# EAGLE design IR4427 (EAGLE 6.6.0)
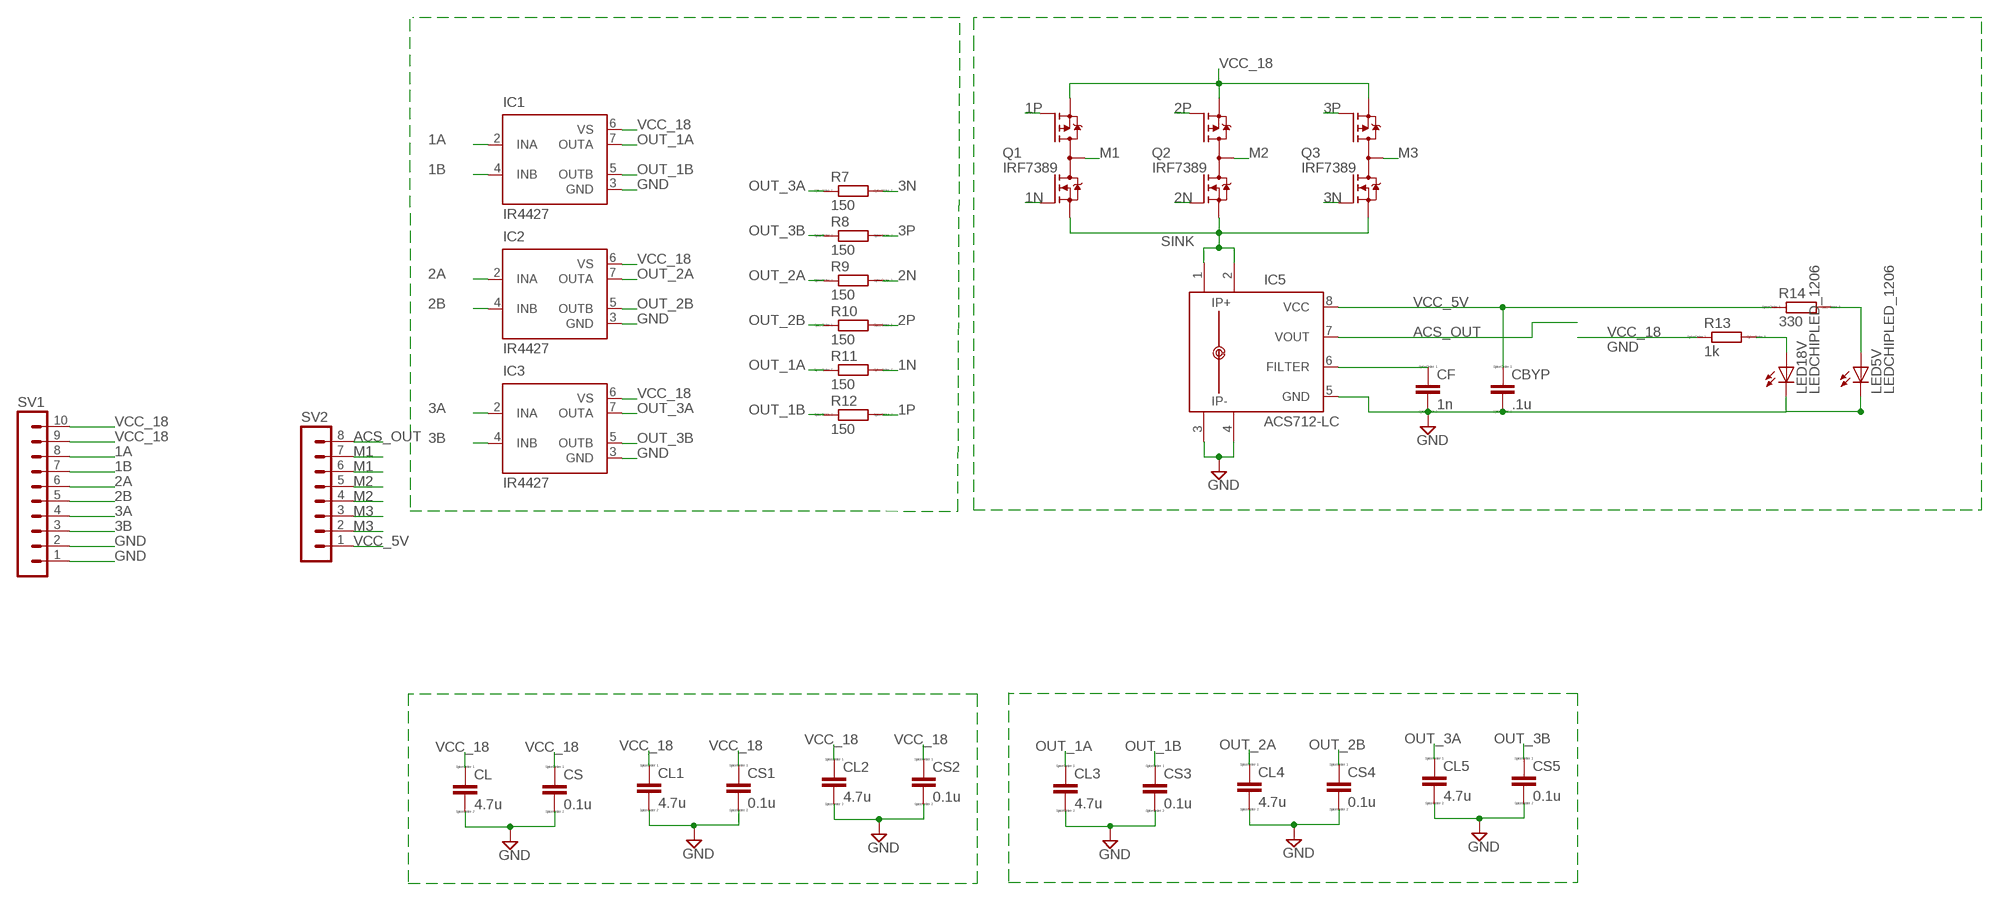
[diagram p0: schematic, sheet 1]

## Parts
CBYP  .1u  CC1206  [C1206]
CF  1n  CC1206  [C1206]
CL  4.7u  CC1206  [C1206]
CL1  4.7u  CC1206  [C1206]
CL2  4.7u  CC1206  [C1206]
CL3  4.7u  CC1206  [C1206]
CL4  4.7u  CC1206  [C1206]
CL5  4.7u  CC1206  [C1206]
CS  0.1u  CC1206  [C1206]
CS1  0.1u  CC1206  [C1206]
CS2  0.1u  CC1206  [C1206]
CS3  0.1u  CC1206  [C1206]
CS4  0.1u  CC1206  [C1206]
CS5  0.1u  CC1206  [C1206]
IC1  IR4427  [DIL08]
IC2  IR4427  [DIL08]
IC3  IR4427  [DIL08]
IC5  ACS712-LC  [SOIC8]
LED5V  LEDCHIPLED_1206  [CHIPLED_1206]
LED18V  LEDCHIPLED_1206  [CHIPLED_1206]
Q1  IRF7389  [SO08-IRF]
Q2  IRF7389  [SO08-IRF]
Q3  IRF7389  [SO08-IRF]
R7  150  RR1206  [R1206]
R8  150  RR1206  [R1206]
R9  150  RR1206  [R1206]
R10  150  RR1206  [R1206]
R11  150  RR1206  [R1206]
R12  150  RR1206  [R1206]
R13  1k  RR1206  [R1206]
R14  330  RR1206  [R1206]
SV1  MA10-1  [MA10-1]
SV2  MA08-1  [MA08-1]

## Nets
1A [signal]: IC1.2(INA) SV1.8
1B [signal]: IC1.4(INB) SV1.7
1N [signal]: Q1.2(N-G) R11.2
1P [signal]: Q1.4(P-G) R12.2
2A [signal]: IC2.2(INA) SV1.6
2B [signal]: IC2.4(INB) SV1.5
2N [signal]: Q2.2(N-G) R9.2
2P [signal]: Q2.4(P-G) R10.2
3A [signal]: IC3.2(INA) SV1.4
3B [signal]: IC3.4(INB) SV1.3
3N [signal]: Q3.2(N-G) R7.2
3P [signal]: Q3.4(P-G) R8.2
ACS_OUT [signal]: IC5.7(VOUT) SV2.8
GND [gnd]: CBYP.2 CF.2 CL1.2 CL2.2 CL3.2 CL4.2 CL5.2 CL.2 CS1.2 CS2.2 CS3.2 CS4.2 CS5.2 CS.2 IC1.3(GND) IC2.3(GND) IC3.3(GND) IC5.3(IP-) IC5.4(IP-1) IC5.5(GND) LED5V.C LED18V.C SV1.1 SV1.2
M1 [motor]: Q1.5(D) Q1.6(D) Q1.7(D) Q1.8(D) SV2.6 SV2.7
M2 [motor]: Q2.5(D) Q2.6(D) Q2.7(D) Q2.8(D) SV2.4 SV2.5
M3 [motor]: Q3.5(D) Q3.6(D) Q3.7(D) Q3.8(D) SV2.2 SV2.3
N$2 [5v]: LED18V.A R13.2
N$3 [5v]: CF.1 IC5.6(FILTER)
N$4 [signal]: LED5V.A R14.2
OUT_1A [signal]: CL3.1 IC1.7(OUTA) R11.1
OUT_1B [signal]: CS3.1 IC1.5(OUTB) R12.1
OUT_2A [signal]: CL4.1 IC2.7(OUTA) R9.1
OUT_2B [signal]: CS4.1 IC2.5(OUTB) R10.1
OUT_3A [signal]: CL5.1 IC3.7(OUTA) R7.1
OUT_3B [signal]: CS5.1 IC3.5(OUTB) R8.1
SINK [signal]: IC5.1(IP+) IC5.2(IP+1) Q1.1(N-S) Q2.1(N-S) Q3.1(N-S)
VCC_5V [5v]: CBYP.1 IC5.8(VCC) R14.1 SV2.1
VCC_18 [motor]: CL1.1 CL2.1 CL.1 CS1.1 CS2.1 CS.1 IC1.6(VS) IC2.6(VS) IC3.6(VS) Q1.3(P-S) Q2.3(P-S) Q3.3(P-S) R13.1 SV1.9 SV1.10

## Library data of the parts
CBYP CF CL CL1-CL5 CS CS1-CS5 = eagle-ltspice:C: CAPACITOR, European symbol; SPICEMODEL: NONE; SPICEPREFIX: C
IC1-IC3 = ir:IR4427: DUAL LOW SIDE DRIVER Source: ID4426.pdf; MF: INTERNATIONAL RECTIFIER(IR); MPN: IR4427; OC_FARNELL: 1023267; OC_NEWARK: 27C6914
IC5 = allegro-2:ACS712-LC
LED5V LED18V = audio amplifier example:LED
Q1-Q3 = transistor-fet:IRF7389: Complimentary Half Bridge HEXFET Power MOSFET Source: http://www.irf.com/product-info/datasheets/data/irf7389.pdf
R7-R14 = eagle-ltspice:R: RESISTOR, European symbol; SPICEMODEL: NONE; SPICEPREFIX: R
SV1 = con-lstb:MA10-1: PIN HEADER; OC_FARNELL: unknown; OC_NEWARK: unknown
SV2 = con-lstb:MA08-1: PIN HEADER; OC_FARNELL: unknown; OC_NEWARK: unknown

## Net classes
0 18v: width 1.4 mm, drill 0.4 mm, clearance 0.152 mm
1 5v: width 0.4 mm, drill 0.4 mm, clearance 0.152 mm
2 motor: width 1.4 mm, drill 0.4 mm, clearance 0.152 mm
3 signal: width 0.3 mm, drill 0.4 mm, clearance 0.152 mm
4 gnd: width 1.4 mm, drill 0.4 mm, clearance 0.152 mm

## Board
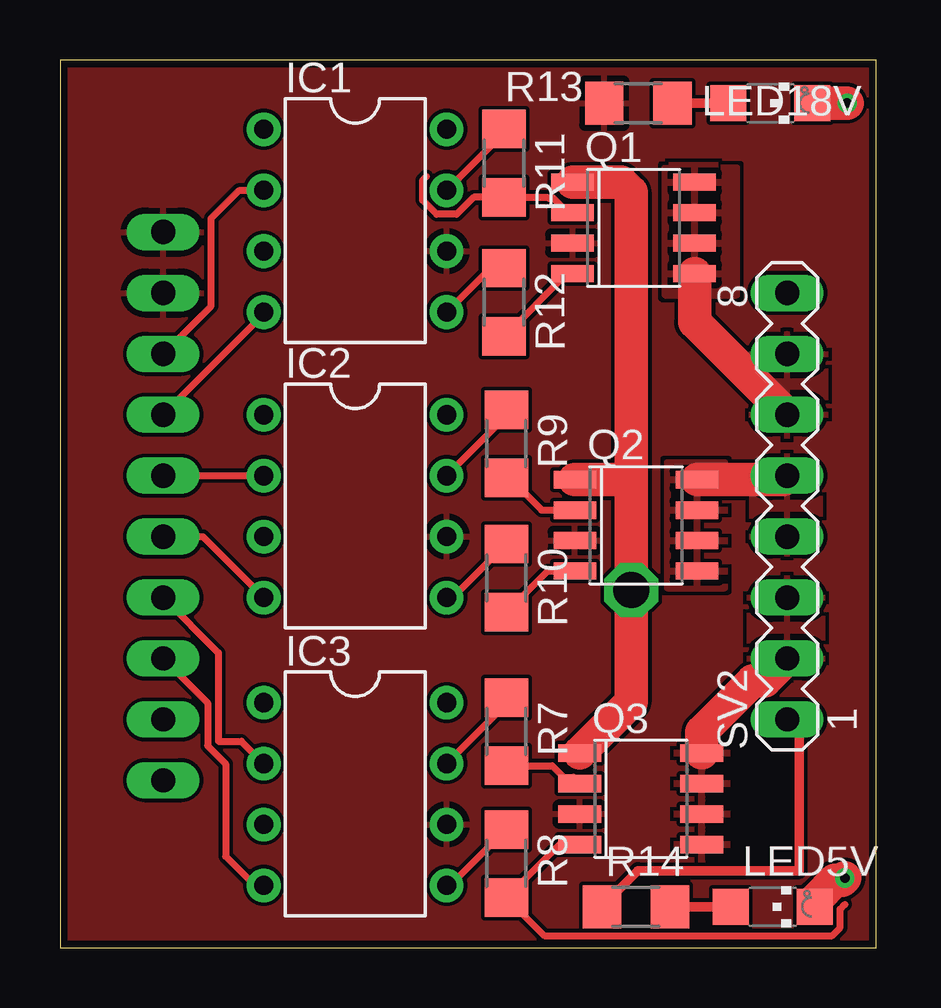
[diagram p1: board, top side]
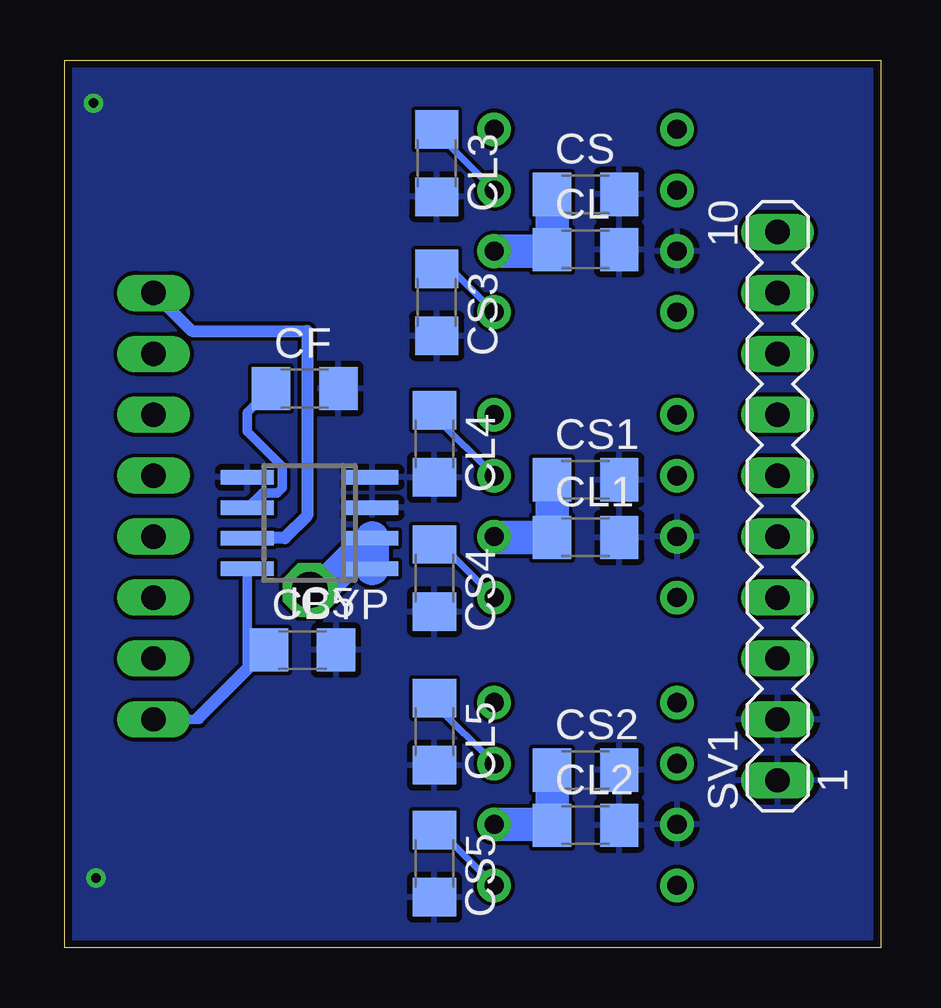
[diagram p2: board, bottom side, seen from below]

Size 34 x 37 mm. Coordinates in mm from the lower left corner, seen from the top.
Outline: 0,0 34,0 34,37 0,37 0,0
Copper layers (1*16): Top 0.035mm / dielectric 1.5mm / Bottom 0.035mm
Design rules "default *": minimum track width 6mil, minimum drill 0.35mm, track to track 6mil, track to pad 6mil, pad to pad 6mil, via to via 6mil, smd to smd 6mil, copper to edge 0.3mm, drill to drill 6mil, minimum pad ring 10mil, minimum via ring 8mil, stop-mask expansion 4mil, vias tented up to drill 0mil, thermal gap 10mil

### Footprints (pad centres in the part's own frame; a part is rotated, then mirrored left to right if it is on the bottom)
C1206 = smd 1.6 x 1.8: 1 -1.4,0; 2 1.4,0
DIL08 = drill 0.8 pad 1.4: 1 -3.81,-3.81; 2 -1.27,-3.81; 3 1.27,-3.81; 4 3.81,-3.81; 5 3.81,3.81; 6 1.27,3.81; 7 -1.27,3.81; 8 -3.81,3.81
SOIC8 = smd 0.6 x 2.2: 1 -1.905,-2.6; 2 -0.635,-2.6; 3 0.635,-2.6; 4 1.905,-2.6; 5 1.905,2.6; 6 0.635,2.6; 7 -0.635,2.6; 8 -1.905,2.6
CHIPLED_1206 = smd 1.5 x 1.5: A 0,-1.75; C 0,1.75
SO08-IRF = smd 0.72 x 1.78: 1 -1.905,-2.543; 2 -0.635,-2.543; 3 0.635,-2.543; 4 1.905,-2.543; 5 1.905,2.543; 6 0.635,2.543; 7 -0.635,2.543; 8 -1.905,2.543
R1206 = smd 1.6 x 1.803: 1 -1.422,0; 2 1.422,0
MA10-1 = drill 1.016 long: 1 -11.43,0; 2 -8.89,0; 3 -6.35,0; 4 -3.81,0; 5 -1.27,0; 6 1.27,0; 7 3.81,0; 8 6.35,0; 9 8.89,0; 10 11.43,0
MA08-1 = drill 1.016 long: 1 -8.89,0; 2 -6.35,0; 3 -3.81,0; 4 -1.27,0; 5 1.27,0; 6 3.81,0; 7 6.35,0; 8 8.89,0

### Placement (x,y rotation side)
CBYP  24.1,12.4 0 bottom
CF  24,23.3 0 bottom
CL  12.3,29.1 0 bottom
CL1  12.3,17.1 0 bottom
CL2  12.3,5.1 0 bottom
CL3  18.5,32.7 270 bottom
CL4  18.6,21 270 bottom
CL5  18.6,9 270 bottom
CS  12.3,31.4 0 bottom
CS1  12.3,19.5 0 bottom
CS2  12.3,7.4 0 bottom
CS3  18.5,26.9 270 bottom
CS4  18.6,15.4 270 bottom
CS5  18.6,3.5 270 bottom
IC1  12.3,30.3 270 top
IC2  12.3,18.4 270 top
IC3  12.3,6.4 270 top
IC5  23.8,17.7 90 bottom
LED5V  29.7,1.7 270 top
LED18V  29.6,35.2 270 top
Q1  23.9,30 270 top
Q2  24,17.6 270 top
Q3  24.2,6.2 270 top
R7  18.6,9 270 top
R8  18.6,3.5 270 top
R9  18.6,21 270 top
R10  18.6,15.4 270 top
R11  18.5,32.7 270 top
R12  18.5,26.9 270 top
R13  24.1,35.2 0 top
R14  24,1.7 0 top
SV1  4.3,18.4 90 bottom
SV2  30.3,18.4 90 top

### Tracks (layer width: path | path; a pad name or v marks a point on that pad's centre or on a via)
1A
  Top 0.3: SV1.8 6.3,26.75 6.3,30.4 7.47,31.57 IC1.2
1B
  Top 0.3: SV1.7 8.49,26.4 IC1.4
1N
  Top 0.3: 15.26,32.14 15.11,31.98 15.11,31.16 15.7,30.57 16.53,30.57 17.24,31.28 R11.2 20.31,31.28 20.34,31.24 20.55,31.24 21.16,30.63 Q1.2
1P
  Top 0.3: R12.2 21.12,28.09 Q1.4
2A
  Top 0.3: SV1.6 IC2.2
2B
  Top 0.3: SV1.5 5.95,17.13 IC2.4
2N
  Top 0.3: R9.2 18.72,19.58 20.07,18.23 Q2.2
2P
  Top 0.3: R10.2 20.32,15.69 Q2.4
3A
  Top 0.3: SV1.4 6.6,12.29 6.6,8.6 7.56,8.6 IC3.2
3B
  Top 0.3: SV1.3 6.15,10.2 6.15,8.41 6.9,7.66 6.9,3.8 8.11,2.59 IC3.4
3N
  Top 0.3: R7.2 20.51,7.58 20.98,7.1 21.39,7.1 Q3.2
3P
  Top 0.3: Q3.4 20.82,4.29 R8.2 20.18,0.5 32.17,0.5 32.5,0.83 32.5,1.6 32.7,1.8
ACS_OUT
  Bottom 0.5: SV2.8 28.71,25.7 23.9,25.7 23.9,18 24.83,17.07 IC5.7
GND  (via drill 0.4)
  Top 1.4: LED5V.C 31.5,1.75 31.5,2.02 32.28,2.8 32.6,2.8 v32.7,2.9 | v32.8,35.2 LED18V.C
  pour Bottom (rank 2): -3.9,43.7 -3.9,-7 6.9,-17.8 53.6,-17.8 67.6,-3.8 43.6,20.2 43.6,50.3 2.7,50.3
M1
  Top 1.4: Q1.5 26.44,26.07 SV2.6
  pour Top: 25.4,32.6 25.4,27.7 27.4,27.7 27.4,32.6
  pour Top: 25.2,32.5 25.2,27.2 28.2,27.2 28.2,32.5
  pour Top: 30.3,25.6 31.9,25.6 31.9,21.3 28.8,21.3 28.8,25.5 28.8,25.6
M2
  Top 1.4: Q2.8 30.14,19.51 SV2.5
  pour Top: 25.3,20.2 25.3,15 27.7,15 27.7,20.2
  pour Top: 28.8,20.4 28.8,16.4 31.7,16.4 31.7,20.4 31.7,20.5 28.8,20.5
M3
  Top 1.4: SV2.2 29.37,11.12 28.87,11.12 26.74,9 Q3.8
  pour Top: 25.7,8.6 25.7,3.7 27.8,3.7 27.8,8.6
  pour Top: 28.7,15.4 28.7,11.3 31.8,11.3 31.8,15.4 31.7,15.4
N$2
  Top 0.4: R13.2 LED18V.A
N$3
  Bottom 0.4: CF.1 26.4,22.3 26.4,21.5 24.95,20.05 24.95,19.16 25.15,18.95 25.78,18.95 IC5.6
N$4
  Top 0.4: LED5V.A R14.2
OUT_1A
  Top 0.3: IC1.7 18.5,33.96 R11.1
  Bottom 0.3: CL3.1 18.5,33.96 IC1.7
OUT_1B
  Top 0.3: IC1.5 17.94,28.32 R12.1
  Bottom 0.3: CS3.1 17.92,28.3 IC1.5
OUT_2A
  Top 0.3: R9.1 18.6,22.16 IC2.7
  Bottom 0.3: CL4.1 18.6,22.16 IC2.7
OUT_2B
  Top 0.3: R10.1 16.37,14.59 IC2.5
  Bottom 0.3: CS4.1 18.32,16.8 IC2.5
OUT_3A
  Top 0.3: IC3.7 18.6,10.16 R7.1
  Bottom 0.3: CL5.1 18.6,10.16 IC3.7
OUT_3B
  Top 0.3: IC3.5 16.27,2.59 R8.1
  Bottom 0.3: CS5.1 18.42,4.9 IC3.5
SINK  (via drill 1.5 pad 1.15)
  Top 1.4: Q1.1 23.39,31.91 23.8,31.5 23.8,19.6 | 23.8,19.6 v23.8,14.9 23.8,10.25 Q3.1 | Q2.1 23.71,19.51 23.8,19.6
  Bottom 1.4: IC5.1 IC5.2 23.36,14.9 v23.8,14.9
VCC_5V
  Top 0.4: R14.1 24.08,3.2 30.8,3.2 30.8,9.01 SV2.1
  Bottom 0.4: SV2.1 28.6,9.51 | 28.6,9.51 28.39,9.51 CBYP.1 | 28.6,9.51 26.4,11.71 IC5.8
VCC_18
  Bottom 1.4: IC2.6 16.08,17.1 CL1.1 CS1.1 | IC1.6 13.77,29.03 CL.1 CS.1 | IC3.6 13.73,5.13 CL2.1 CS2.1
  pour Top (rank 2): -1.7,39.9 -1.7,-2.7 3.3,-7.7 45.5,-7.7 62.6,9.4 51,21 51,44.9 46,39.9